# Altium schematic sheet 4.以太网_eth1.SchDoc
size 297 x 209 mm; SheetNumber: 4; SheetTotal: 13
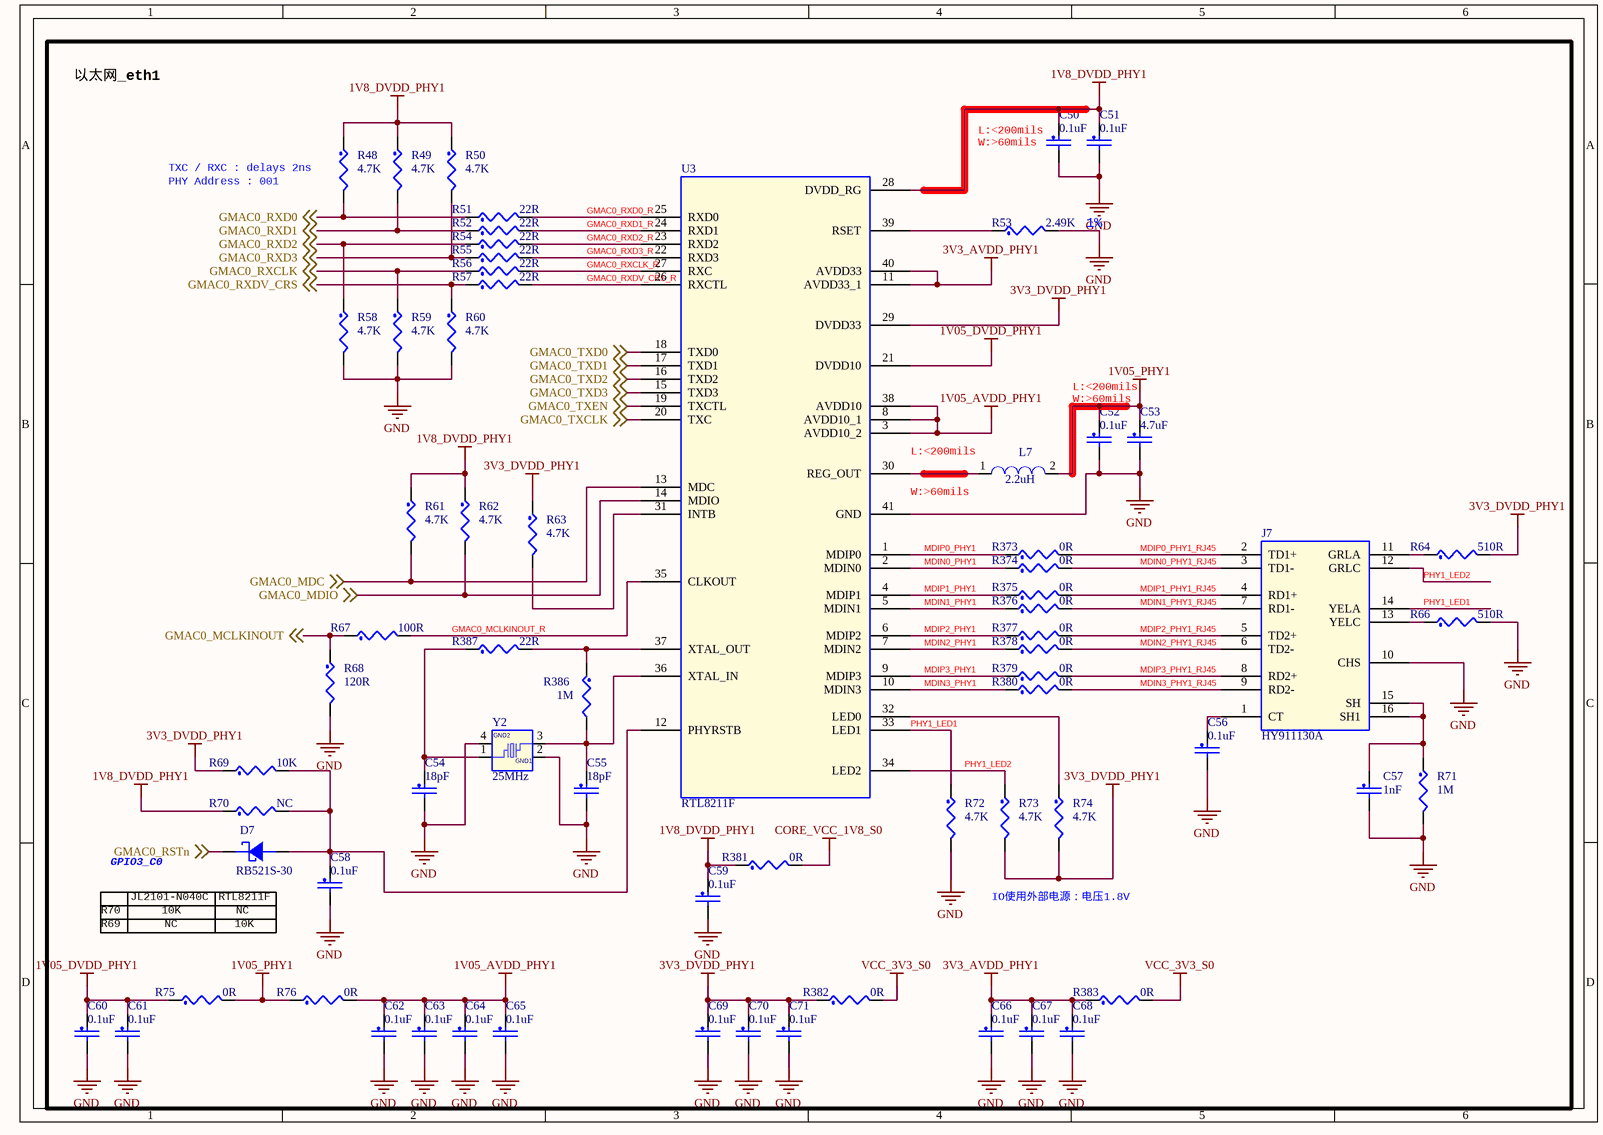
[diagram p0: 4.以太网_eth1.SchDoc]

## Parts
C50  0.1uF  [C0402]
C51  0.1uF  [C0402]
C52  0.1uF  [C0402]
C53  4.7uF  [C0402]
C54  18pF  [C0402]
C55  18pF  [C0402]
C56  0.1uF  [C0402]
C57  1nF  [C0805]
C58  0.1uF  [C0402]
C59  0.1uF  [C0402]
C60  0.1uF  [C0402]
C61  0.1uF  [C0402]
C62  0.1uF  [C0402]
C63  0.1uF  [C0402]
C64  0.1uF  [C0402]
C65  0.1uF  [C0402]
C66  0.1uF  [C0402]
C67  0.1uF  [C0402]
C68  0.1uF  [C0402]
C69  0.1uF  [C0402]
C70  0.1uF  [C0402]
C71  0.1uF  [C0402]
D7  RB521S-30  [SOD523]
J7  HY911130A  [HY911130A]
L7  2.2uH  [L2520]
R48  4.7K  [R0402]
R49  4.7K  [R0402]
R50  4.7K  [R0402]
R51  22R  [R0402]
R52  22R  [R0402]
R53  2.49K  [R0402]
R54  22R  [R0402]
R55  22R  [R0402]
R56  22R  [R0402]
R57  22R  [R0402]
R58  4.7K  [R0402]
R59  4.7K  [R0402]
R60  4.7K  [R0402]
R61  4.7K  [R0402]
R62  4.7K  [R0402]
R63  4.7K  [R0402]
R64  510R  [R0603]
R66  510R  [R0603]
R67  100R  [R0402]
R68  120R  [R0402]
R69  10K  [R0402]
R70  NC  [R0402]
R71  1M  [R0805]
R72  4.7K  [R0402]
R73  4.7K  [R0402]
R74  4.7K  [R0402]
R75  0R  [R0402]
R76  0R  [R0402]
R373  0R  [R0201]
R374  0R  [R0201]
R375  0R  [R0201]
R376  0R  [R0201]
R377  0R  [R0201]
R378  0R  [R0201]
R379  0R  [R0201]
R380  0R  [R0201]
R381  0R  [R0402]
R382  0R  [R0402]
R383  0R  [R0402]
R386  1M  [R0402]
R387  22R  [R0402]
U3  RTL8211F  [qfp_40p_r]
Y2  25MHz  [3225]

## Nets
1V05_AVDD_PHY1: C62.1 C63.1 C64.1 C65.1 R76.2 U3.3(AVDD10_2) U3.8(AVDD10_1) U3.38(AVDD10)
1V05_DVDD_PHY1: C60.1 C61.1 R75.1 U3.21(DVDD10)
1V05_PHY1: C52.1 C53.1 L7.2 R75.2 R76.1
1V8_DVDD_PHY1: C50.1 C51.1 C59.1 R48.1 R49.1 R50.1 R61.1 R62.1 R70.1 R381.1 U3.28(DVDD_RG)
3V3_AVDD_PHY1: C66.1 C67.1 C68.1 R383.1 U3.11(AVDD33_1) U3.40(AVDD33)
3V3_DVDD_PHY1: C69.1 C70.1 C71.1 R63.1 R64.2 R69.1 R73.2 R74.2 R382.1 U3.29(DVDD33)
CORE_VCC_1V8_S0: R381.2
GND: C50.2 C51.2 C52.2 C53.2 C54.2 C55.2 C56.2 C57.2 C58.2 C59.2 C60.2 C61.2 C62.2 C63.2 C64.2 C65.2 C66.2 C67.2 C68.2 C69.2 C70.2 C71.2 J7.10(CHS) R53.2 R58.2 R59.2 R60.2 R66.2 R68.2 R71.2 R72.2 U3.41(GND) Y2.2(GND1) Y2.4(GND2)
VCC_3V3_S0: R382.2 R383.2
GMAC0_MCLKINOUT: R67.1 R68.1 ; off-sheet GMAC0_MCLKINOUT
GMAC0_MCLKINOUT_R: R67.2 U3.35(CLKOUT)
GMAC0_MDC: R61.2 U3.13(MDC) ; off-sheet GMAC0_MDC
GMAC0_MDIO: R62.2 U3.14(MDIO) ; off-sheet GMAC0_MDIO
GMAC0_RSTn: D7.1 ; off-sheet GMAC0_RSTn
GMAC0_RXCLK: R56.1 R59.1 ; off-sheet GMAC0_RXCLK
GMAC0_RXCLK_R: R56.2 U3.27(RXC)
GMAC0_RXD0: R48.2 R51.1 ; off-sheet GMAC0_RXD0
GMAC0_RXD0_R: R51.2 U3.25(RXD0)
GMAC0_RXD1: R49.2 R52.1 ; off-sheet GMAC0_RXD1
GMAC0_RXD1_R: R52.2 U3.24(RXD1)
GMAC0_RXD2: R54.1 R58.1 ; off-sheet GMAC0_RXD2
GMAC0_RXD2_R: R54.2 U3.23(RXD2)
GMAC0_RXD3: R50.2 R55.1 ; off-sheet GMAC0_RXD3
GMAC0_RXD3_R: R55.2 U3.22(RXD3)
GMAC0_RXDV_CRS: R57.1 R60.1 ; off-sheet GMAC0_RXDV_CRS
GMAC0_RXDV_CRS_R: R57.2 U3.26(RXCTL)
GMAC0_TXCLK: U3.20(TXC) ; off-sheet GMAC0_TXCLK
GMAC0_TXD0: U3.18(TXD0) ; off-sheet GMAC0_TXD0
GMAC0_TXD1: U3.17(TXD1) ; off-sheet GMAC0_TXD1
GMAC0_TXD2: U3.16(TXD2) ; off-sheet GMAC0_TXD2
GMAC0_TXD3: U3.15(TXD3) ; off-sheet GMAC0_TXD3
GMAC0_TXEN: U3.19(TXCTL) ; off-sheet GMAC0_TXEN
MDIN0_PHY1: R374.1 U3.2(MDIN0)
MDIN0_PHY1_RJ45: J7.3(TD1-) R374.2
MDIN1_PHY1: R376.1 U3.5(MDIN1)
MDIN1_PHY1_RJ45: J7.7(RD1-) R376.2
MDIN2_PHY1: R378.1 U3.7(MDIN2)
MDIN2_PHY1_RJ45: J7.6(TD2-) R378.2
MDIN3_PHY1: R380.1 U3.10(MDIN3)
MDIN3_PHY1_RJ45: J7.9(RD2-) R380.2
MDIP0_PHY1: R373.1 U3.1(MDIP0)
MDIP0_PHY1_RJ45: J7.2(TD1+) R373.2
MDIP1_PHY1: R375.1 U3.4(MDIP1)
MDIP1_PHY1_RJ45: J7.4(RD1+) R375.2
MDIP2_PHY1: R377.1 U3.6(MDIP2)
MDIP2_PHY1_RJ45: J7.5(TD2+) R377.2
MDIP3_PHY1: R379.1 U3.9(MDIP3)
MDIP3_PHY1_RJ45: J7.8(RD2+) R379.2
PHY1_LED1: J7.14(YELA) R72.1 U3.33(LED1)
PHY1_LED2: J7.12(GRLC) R73.1 U3.34(LED2)
NetC54_1: C54.1 R387.1 Y2.1
NetC55_1: C55.1 R386.2 U3.36(XTAL_IN) Y2.3
NetC56_1: C56.1 J7.1(CT)
NetC57_1: C57.1 J7.15(SH) J7.16(SH1) R71.1
NetC58_1: C58.1 D7.2 R69.2 R70.2 U3.12(PHYRSTB)
NetJ7_11: J7.11(GRLA) R64.1
NetJ7_13: J7.13(YELC) R66.1
NetL7_1: L7.1 U3.30(REG_OUT)
NetR53_1: R53.1 U3.39(RSET)
NetR63_2: R63.2 U3.31(INTB)
NetR74_1: R74.1 U3.32(LED0)
NetR386_1: R386.1 R387.2 U3.37(XTAL_OUT)

## Notes on the sheet
- 以太网_eth1
- PHY Address : 001
- TXC / RXC : delays 2ns
- (near C50) L:<200mils
  W:>60mils
- (near R53) 1%
- L:<200mils
  W:>60mils
- L:<200mils
- W:>60mils
- GPIO3_C0
- R70
- R69
- JL2101-N040C
- 10K
- NC
- (near D7) RTL8211F
- IO使用外部电源：电压1.8V

## Library data of the parts
C50-C71 = CAP_NP
D7 = DIODE_SCHTKY
L7 = IND
R48-R64 R66-R76 R373-R383 R386 R387 = RES
Y2 = CRYSTAL_4P